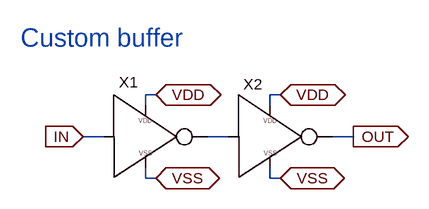
[diagram p0: schematic my_buffer.asc]
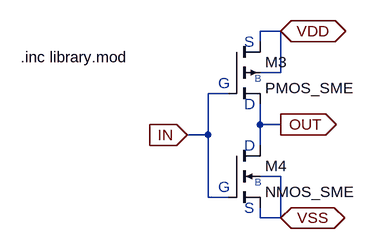
[diagram p1: sub-circuit my_inverter.asc]
my_buffer.asc, the LTspice schematic file:
Version 4.1
SHEET 1 880 680
WIRE 112 144 96 144
WIRE 304 144 288 144
WIRE 96 160 96 144
WIRE 288 160 288 144
WIRE 32 208 0 208
WIRE 224 208 192 208
WIRE 416 208 384 208
WIRE 96 272 96 256
WIRE 112 272 96 272
WIRE 288 272 288 256
WIRE 304 272 288 272
FLAG 0 208 IN
IOPIN 0 208 In
FLAG 416 208 OUT
IOPIN 416 208 Out
FLAG 112 144 VDD
IOPIN 112 144 BiDir
FLAG 304 144 VDD
IOPIN 304 144 BiDir
FLAG 304 272 VSS
IOPIN 304 272 BiDir
FLAG 112 272 VSS
IOPIN 112 272 BiDir
SYMBOL my_inverter 96 208 R0
WINDOW 0 -26 -68 Bottom 2
SYMATTR InstName X1
SYMBOL my_inverter 288 208 R0
WINDOW 0 -26 -65 Bottom 2
SYMATTR InstName X2
TEXT -96 56 Left 4 ;Custom buffer

my_inverter.asc, the sub-circuit schematic file:
Version 4.1
SHEET 1 880 680
WIRE 608 -32 576 -32
WIRE 576 -16 576 -32
WIRE 608 32 608 -32
WIRE 608 32 576 32
WIRE 528 64 496 64
WIRE 576 112 576 80
WIRE 608 112 576 112
WIRE 496 128 496 64
WIRE 496 128 464 128
WIRE 576 144 576 112
WIRE 608 192 576 192
WIRE 496 224 496 128
WIRE 528 224 496 224
WIRE 576 256 576 240
WIRE 608 256 608 192
WIRE 608 256 576 256
FLAG 608 -32 VDD
IOPIN 608 -32 BiDir
FLAG 608 256 VSS
IOPIN 608 256 BiDir
FLAG 608 112 OUT
IOPIN 608 112 Out
FLAG 464 128 IN
IOPIN 464 128 In
SYMBOL pmos4 528 -16 R0
SYMATTR InstName M3
SYMATTR Value PMOS_SME
SYMATTR Value2 l=0.35u w=0.4u
SYMBOL nmos4 528 144 R0
SYMATTR InstName M4
SYMATTR Value NMOS_SME
SYMATTR Value2 l=0.35u w=0.4u
TEXT 552 -16 Left 2 ;S
TEXT 552 240 Left 2 ;S
TEXT 552 80 Left 2 ;D
TEXT 552 144 Left 2 ;D
TEXT 512 48 Left 2 ;G
TEXT 512 208 Left 2 ;G
TEXT 568 40 Left 1 ;B
TEXT 568 200 Left 1 ;B
TEXT 208 8 Left 2 !.inc library.mod

The netlist it stands for:
* my_buffer.asc
X§X1 IN N001 VDD VSS my_inverter
X§X2 N001 OUT VDD VSS my_inverter

* block symbol definitions
.subckt my_inverter IN OUT VDD VSS
M3 VDD IN OUT VDD PMOS_SME l=0.35u w=0.4u
M4 OUT IN VSS VSS NMOS_SME l=0.35u w=0.4u
* S
* S
* D
* D
* G
* G
* B
* B
.inc library.mod
.ends my_inverter

.model NMOS NMOS
.model PMOS PMOS
.lib standard.mos
* Custom buffer
.backanno
.end